# Altium project Grad_Source.PrjPcb
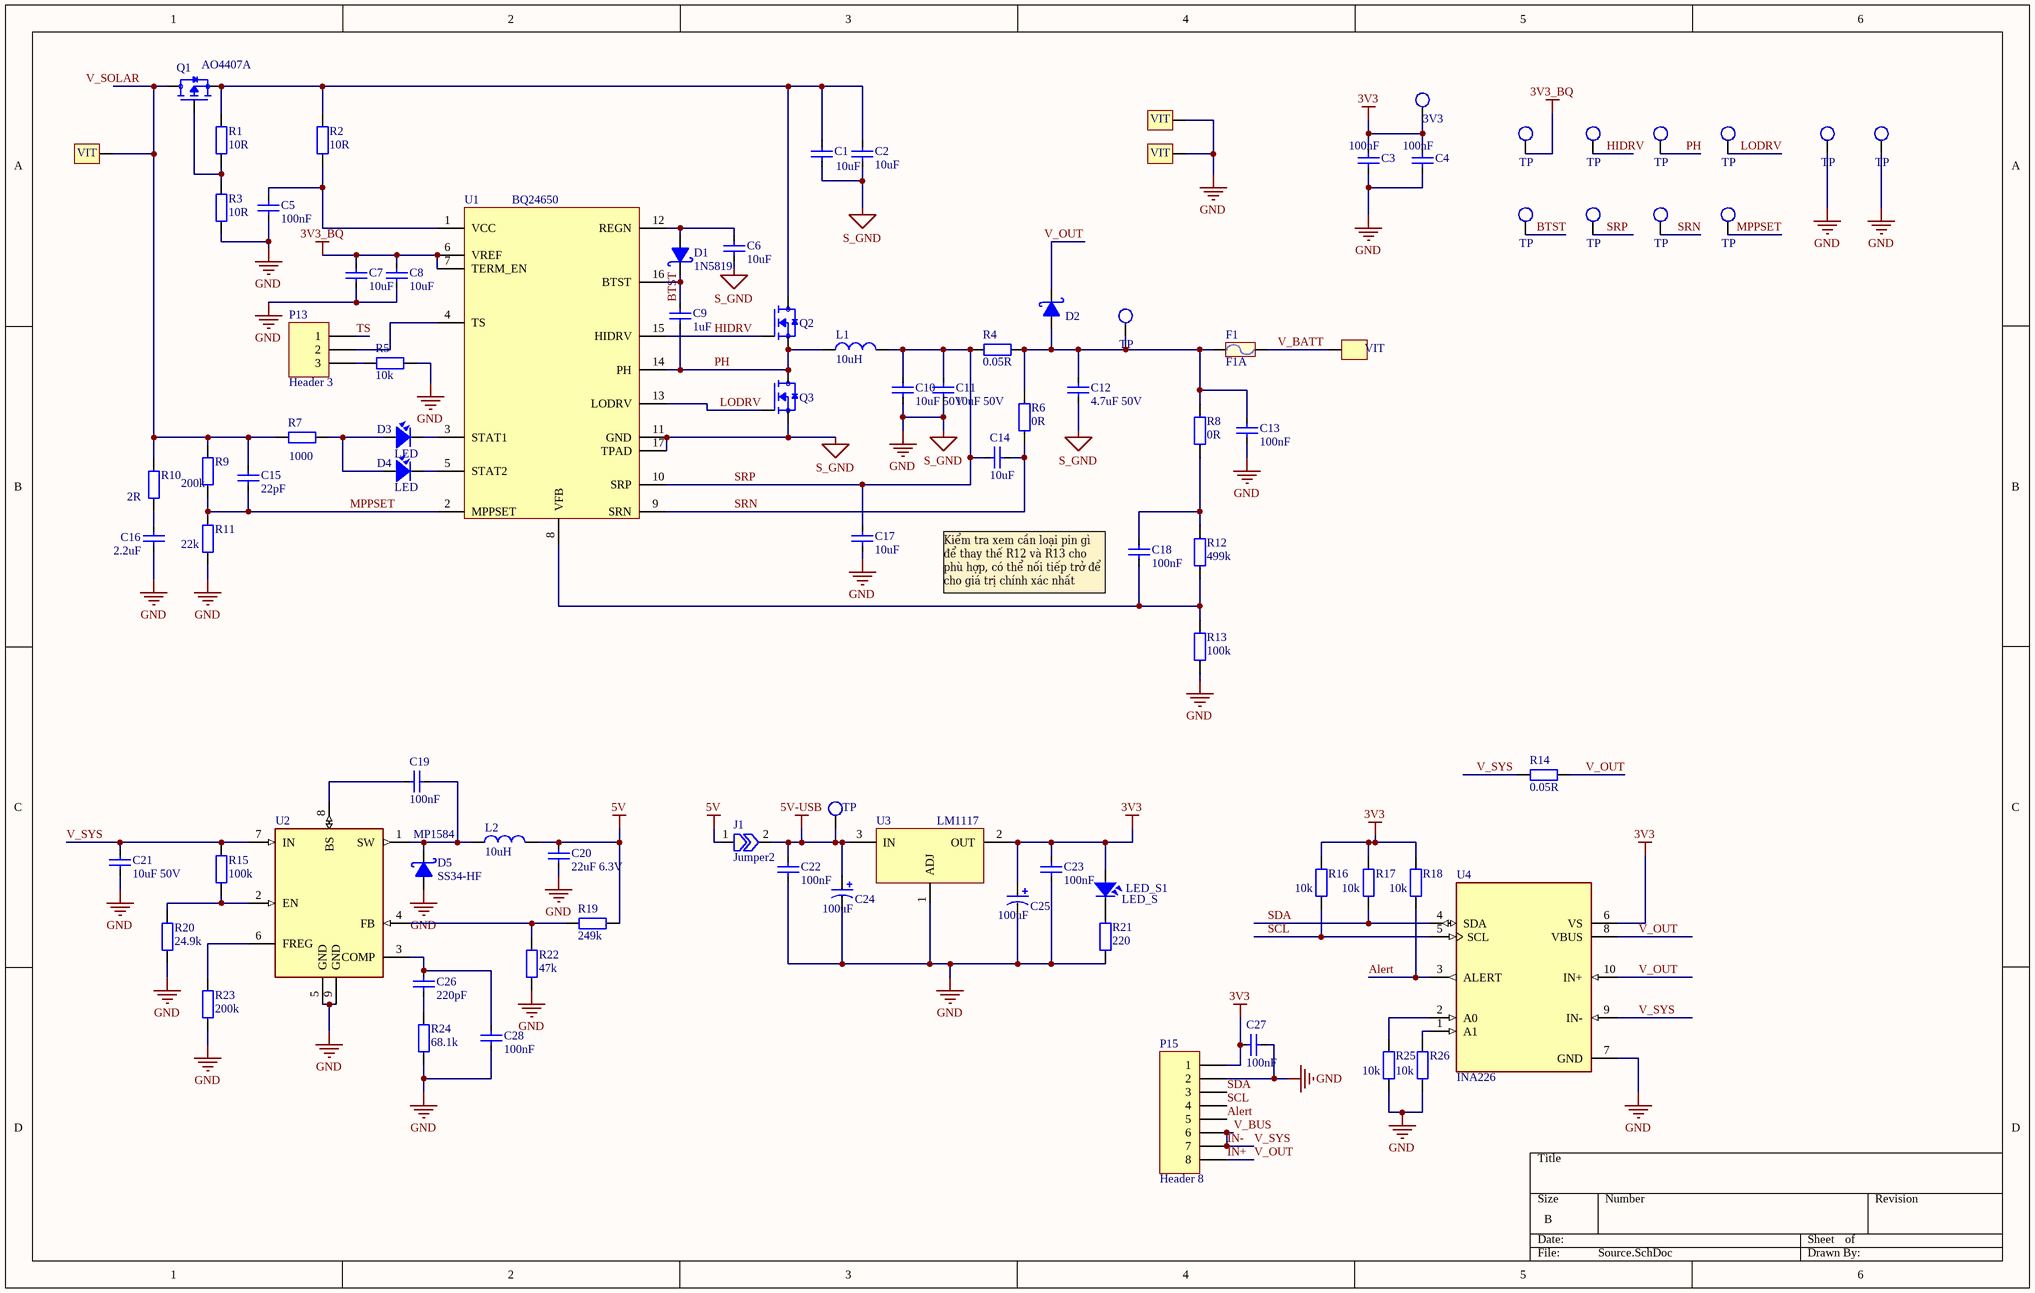
[diagram p0: Source.SchDoc]
2 sheets, 125 parts. Net scope: global (net labels, ports and power ports of the same name join across sheets).
Board file: Source_module.PcbDoc
Sheets:
  Source.SchDoc
  Controller.SchDoc

## Sheet Source.SchDoc
size B; SheetNumber: 1; SheetTotal: 2

### Parts
C1  10uF  [CAP_3216]
C2  10uF  [CAP_3216]
C3  100nF  [CAP_0805]
C4  100nF  [CAP_0805]
C5  100nF  [CAP_0805]
C6  10uF  [CAP_0805]
C7  10uF  [CAP_0805]
C8  10uF  [CAP_0805]
C9  1uF  [CAP_0805]
C10  10uF 50V  [CAP_1206]
C11  10uF 50V  [CAP_1206]
C12  4.7uF 50V  [CAP_1206]
C13  100nF  [CAP_0805]
C14  10uF  [CAP_0805]
C15  22pF  [CAP_0805]
C16  2.2uF  [CAP_0805]
C17  10uF  [CAP_0805]
C18  100nF  [CAP_0805]
C19  100nF  [CAP_0805]
C20  22uF 6.3V  [CAP_0805]
C21  10uF 50V  [CAP_3216]
C22  100nF  [CAP_0805]
C23  100nF  [CAP_0805]
C24  100uF  [CAP_7343]
C25  100uF  [CAP_7343]
C26  220pF  [CAP_0805]
C27  100nF  [CAP_0805]
C28  100nF  [CAP_0805]
D1  1N5819  [DIO-SMD-123]
D2  Diode Schottky  [DIO-214AA(SMB)]  (value not drawn)
D3  LED  [LED-0805-Green]
D4  LED  [LED-0805-Red]
D5  SS34-HF  [SMA]
F1  F1A  [RES-SMD-1812]
J1  Jumper2  [RES-SMD-0402]  (no BOM)
L1  10uH  [L-SMD-M-12x10]
L2  10uH  [L-SMD-M-7.3x4.5]
LED_S1  LED_S  [LED-0805-Blue]
P1  3V3  [Testpoint 50ml]  (no BOM)
P2  TP  [Testpoint 50ml]  (no BOM)
P3  TP  [Testpoint 50ml]  (no BOM)
P4  TP  [Testpoint 50ml]  (no BOM)
P5  TP  [Testpoint 50ml]  (no BOM)
P6  TP  [Testpoint 50ml]  (no BOM)
P7  TP  [Testpoint 50ml]  (no BOM)
P8  TP  [Testpoint 50ml]  (no BOM)
P9  TP  [Testpoint 50ml]  (no BOM)
P10  TP  [Testpoint 50ml]  (no BOM)
P11  TP  [Testpoint 50ml]  (no BOM)
P12  TP  [Testpoint 50ml]  (no BOM)
P13  Header 3  [HDR1X3]  (no BOM)
P14  TP  [Testpoint 50ml]  (no BOM)
P15  Header 8  [HDR1X8]  (no BOM)
Q1  AO4407A  [SOIC-8]
Q2  AON6508  [MOSFET_HP_8Pin]  (value not drawn)
Q3  AON6508  [MOSFET_HP_8Pin]  (value not drawn)
R1  10R  [RES-SMD-0805]
R2  10R  [RES-SMD-0805]
R3  10R  [RES-SMD-0805]
R4  0.05R  [RES-SMD-2512]
R5  10k  [RES-SMD-0805]
R6  0R  [RES-SMD-0805]
R7  1000  [RES-SMD-0805]
R8  0R  [RES-SMD-0805]
R9  200k  [RES-SMD-0805]
R10  2R  [RES-SMD-2512]
R11  22k  [RES-SMD-0805]
R12  499k  [RES-SMD-0805]
R13  100k  [RES-SMD-0805]
R14  0.05R  [RES-SMD-2512]
R15  100k  [RES-SMD-0805]
R16  10k  [RES-SMD-0805]
R17  10k  [RES-SMD-0805]
R18  10k  [RES-SMD-0805]
R19  249k  [RES-SMD-0805]
R20  24.9k  [RES-SMD-0805]
R21  220  [RES-SMD-0805]
R22  47k  [RES-SMD-0805]
R23  200k  [RES-SMD-0805]
R24  68.1k  [RES-SMD-0805]
R25  10k  [RES-SMD-0805]
R26  10k  [RES-SMD-0805]
U1  BQ24650  [VQFN-16]
U2  MP1584  [SOP8-PP]
U3  LM1117  [SOT-223]
U4  INA226  [VSSOP-10]
VIT1  1  [VIT]  (value not drawn)  (no BOM)
VIT2  1  [VIT]  (value not drawn)  (no BOM)
VIT3  1  [VIT]  (value not drawn)  (no BOM)
VIT4  1  [VIT]  (value not drawn)  (no BOM)

### Nets
3V3: C3.2 C4.2 C23.2 C25.1 C27.2 LED_S1.1 P1.1 P15.1 R16.1 R17.1 R18.1 U3.2(OUT) U4.6(VS)
3V3_BQ: C7.2 C8.2 P2.1 U1.6(VREF) U1.7(TERM_EN)
5V: C20.2 J1.1 L2.2 R19.1
5V-USB: C22.2 C24.1 J1.2 P14.1 U3.3(IN)
GND: C1.1 C2.1 C3.1 C4.1 C5.1 C6.1 C7.1 C8.1 C10.1 C11.1 C12.2 C13.1 C16.1 C17.1 C20.1 C21.1 C22.1 C23.1 C24.2 C25.2 C27.1 C28.1 D5.1(A) P6.1 P7.1 P15.2 Q3.1,2,3(S) R3.2 R5.2 R11.2 R13.2 R20.2 R21.2 R22.2 R23.2 R24.2 R25.2 R26.2 U1.11(GND) U1.17(TPAD) U2.5(GND) U2.9(GND) U3.1(ADJ) U4.7(GND) VIT1.VIT1 VIT3.VIT1  [also labelled S_GND]
Alert: P15.5 R18.2 U4.3(ALERT)
BTST: C9.2 D1.2(K) P8.1 U1.16(BTST)
HIDRV: P3.1 Q2.4(G) U1.15(HIDRV)
IN+: D2.2(K) P15.8 R14.1 U4.8(VBUS) U4.10(IN+)  [also labelled V_OUT]
IN-: C21.2 P15.6 P15.7 R14.2 R15.1 U2.7(IN) U4.9(IN-)  [also labelled V_BUS, V_SYS]
LODRV: P5.1 Q3.4(G) U1.13(LODRV)
MPPSET: C15.1 P11.1 R9.2 R11.1 U1.2(MPPSET)
PH: C9.1 L1.1 P4.1 Q2.1,2,3(S) Q3.5,6,7,8,9(D) U1.14(PH)
SCL: P15.4 R16.2 U4.5(SCL)
SDA: P15.3 R17.2 U4.4(SDA)
SRN: C14.1 P10.1 R6.2 U1.9(SRN)
SRP: C10.2 C11.2 C14.2 C17.2 L1.2 P9.1 R4.2 U1.10(SRP)
TS: P13.1
V_BATT: F1.2 VIT4.VIT1
V_SOLAR: C15.2 Q1.5,_6,_7,_8(D) R7.2 R9.1 R10.1 VIT2.VIT1
NetC1_2: C1.2 C2.2 Q1.1,_2,_3(S) Q2.5,6,7,8,9(D) R1.1 R2.1
NetC5_2: C5.2 R2.2 U1.1(VCC)
NetC6_2: C6.2 D1.1(A) U1.12(REGN)
NetC12_1: C12.1 C13.2 D2.1(A) F1.1 P12.1 R4.1 R6.1 R8.1
NetC16_2: C16.2 R10.2
NetC18_1: C18.1 R12.2 R13.1 U1.8(VFB)
NetC18_2: C18.2 R8.2 R12.1
NetC19_1: C19.1 U2.8(BS)
NetC19_2: C19.2 D5.2(K) L2.1 U2.1(SW)
NetC26_1: C26.1 R24.1
NetC26_2: C26.2 C28.2 U2.3(COMP)
NetD3_1: D3.1 D4.1 R7.1
NetD3_2: D3.2 U1.3(STAT1)
NetD4_2: D4.2 U1.5(STAT2)
NetLED_S1_2: LED_S1.2 R21.1
NetP13_2: P13.2 U1.4(TS)
NetP13_3: P13.3 R5.1
NetQ1_4: Q1.4(G) R1.2 R3.1
NetR15_2: R15.2 R20.1 U2.2(EN)
NetR19_2: R19.2 R22.1 U2.4(FB)
NetR23_1: R23.1 U2.6(FREG)
NetR25_1: R25.1 U4.2(A0)
NetR26_1: R26.1 U4.1(A1)

### Notes on the sheet
- (near C18) Kiểm tra xem cần loại pin gì để thay thế R12 và R13 cho phù hợp, có thể nối tiếp trở để cho giá trị chính xác nhất

### Library data of the parts
C1 C2 = CapSMD: C 3216; Value: 33p; Published: 8-Jun-2000; LatestRevisionDate: 17-Jul-2002; LatestRevisionNote: Re-released for DXP Platform.; PackageReference: RAD-0.3; Publisher: Altium Limited
C3-C9 C13-C20 C22 C23 C26-C28 = CapSMD: C 0805; Value: 33p; Published: 8-Jun-2000; LatestRevisionDate: 17-Jul-2002; LatestRevisionNote: Re-released for DXP Platform.; PackageReference: RAD-0.3; Publisher: Altium Limited
C10-C12 C21 = CapSMD: C 1206; Value: 33p; Published: 8-Jun-2000; LatestRevisionDate: 17-Jul-2002; LatestRevisionNote: Re-released for DXP Platform.; PackageReference: RAD-0.3; Publisher: Altium Limited
C24 C25 = CAP_TAN_SMD: C Tan 7343
D1 D5 = 1N5822: Schottky Rectifiers; Value: Diode c?m 1N5408
D2 = Diode Schottky: SS54
D3 D4 LED_S1 = LED: LED Single colour Green and Red; Value: LED 3 ly Single Colour
F1 = Fuse: Fuse 5A; Designed by: VanDungEvn; Value: Fuse
J1 = Jumper2: Jumper, 2-Pin
L1 = Inductor: Value: 150 mH
L2 = Inductor: 6.8-10uH; Value: 150 mH
P1-P12 P14 = TP_1: Test Point; Value: Test Point
P13 = Header 3: Header, 3-Pin; LatestRevisionDate: 17-Jul-2002; LatestRevisionNote: Re-released for DXP Platform.; Publisher: Altium Limited
P15 = Header 8: Header, 8-Pin; LatestRevisionDate: 17-Jul-2002; LatestRevisionNote: Re-released for DXP Platform.; Publisher: Altium Limited
Q1 = MOSFET-P: MFET-ChP; ComponentLink1Description: New link; ComponentLink1URL: https://linhkien.cxtvn.com/3834-ru20p7c-mosfet-p-ch-5a-20v-sot-23.html
Q2 Q3 = MOSFET-N: MFET-CHP
R1-R3 R5-R7 R15-R18 R21 R23-R26 = Resistor - SMD: R 0805; Manufacturer: Generic Components; Class: Passive; Published: 08/06/2000; Publisher: Altium Hobart Technology Centre
R4 R14 = Resistor - SMD: R 2512 1%; Manufacturer: Generic Components; Class: Passive; Published: 08/06/2000; Publisher: Altium Hobart Technology Centre
R8 R9 R11-R13 R19 R20 R22 = Resistor - SMD: R 0805 1%; Manufacturer: Generic Components; Class: Passive; Published: 08/06/2000; Publisher: Altium Hobart Technology Centre
R10 = Resistor - SMD: R 2512; Manufacturer: Generic Components; Class: Passive; Published: 08/06/2000; Publisher: Altium Hobart Technology Centre
U1 = BQ24650: BQ24650 Stand-Alone Synchronous Buck Battery Charge Controller for Solar Power / With Maximum Power Point Tracking
U2 = MP1584: MP1584, The wide 4.5V to 28V input range accommodates a   variety   of   step-down   applications, SOIC8E
U3 = LM1117: 3V3 5V LDO, AMS1117, LDI1117; Creator: Nguyen Ba Bien; Website: http://group3i.net
U4 = INA226: Current Sensing IC
VIT1-VIT4 = VIT: Oc Vit

## Sheet Controller.SchDoc
size A4; SheetNumber: 2; SheetTotal: 2
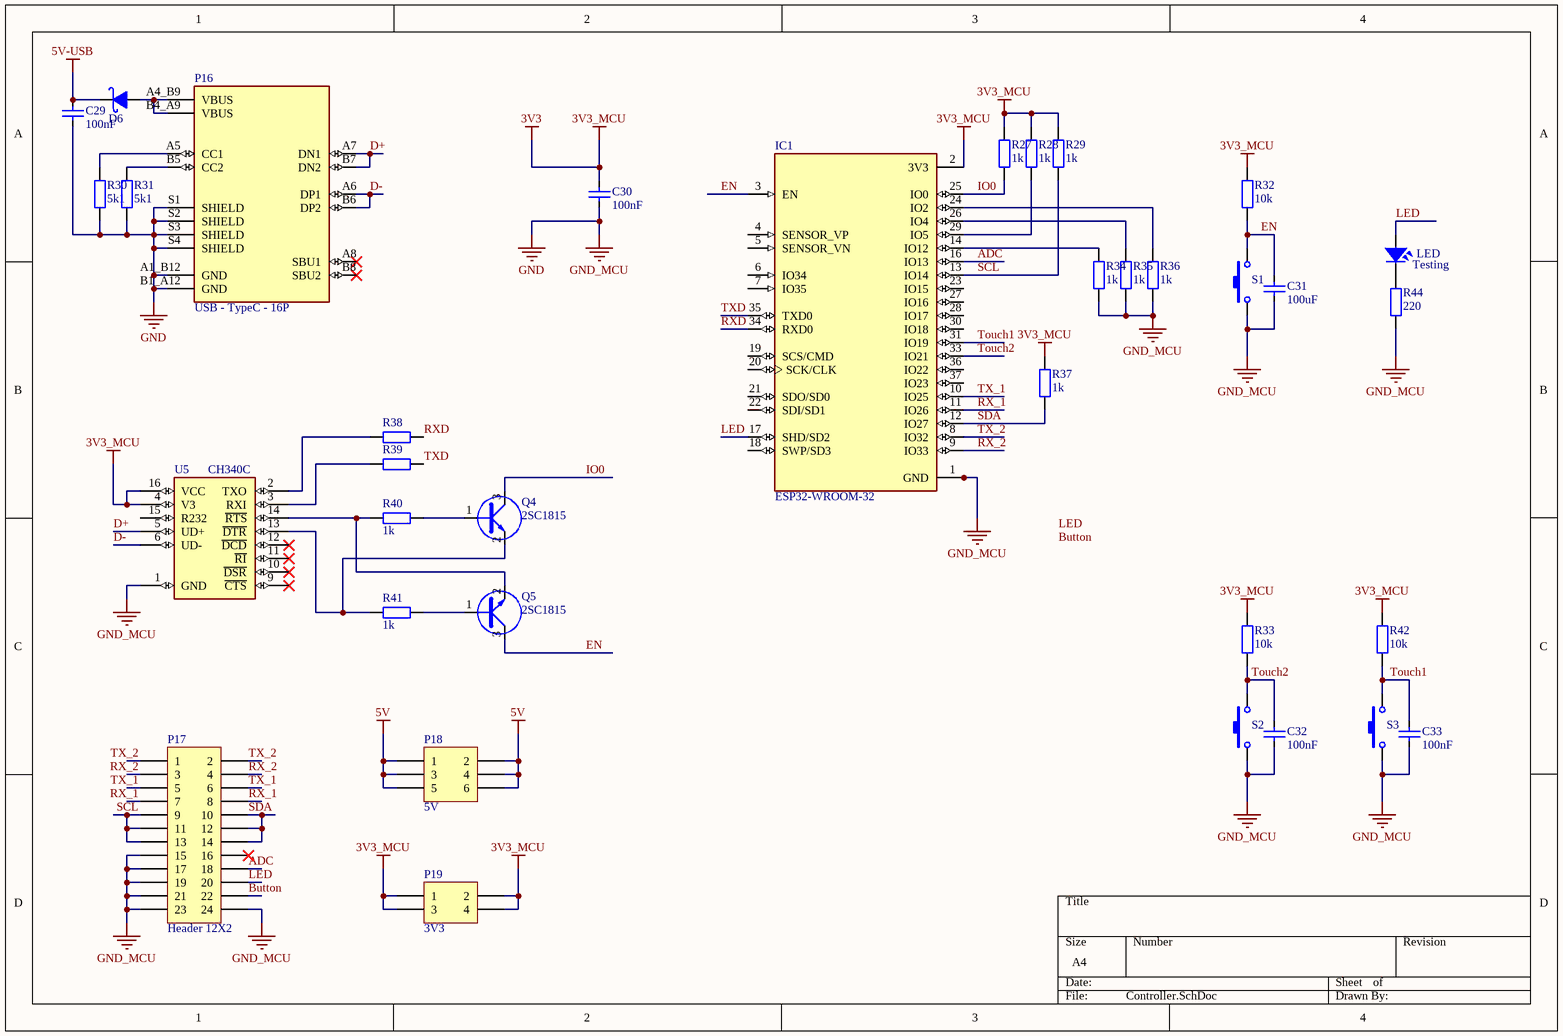
[diagram p1: Controller.SchDoc]

### Parts
C29  100nF  [CAP_0805]
C30  100nF  [CAP_0805]
C31  100uF  [CAP_0805]
C32  100nF  [CAP_0805]
C33  100nF  [CAP_0805]
D6  Diode Schottky  [DIO-214AA(SMB)]  (value not drawn)
IC1  ESP32-WROOM-32  [MODULE_ESP32-WROOM-32]
LED  Testing  [LED-0805-Blue]
P16  USB - TypeC - 16P  [USB C 16P]
P17  Header 12X2  [HDR2X12]  (no BOM)
P18  5V  [HDR2X3]  (no BOM)
P19  3V3  [HDR2X2]  (no BOM)
Q4  2SC1815  [SOT23D]
Q5  2SC1815  [SOT23D]
R27  1k  [RES-SMD-0805]
R28  1k  [RES-SMD-0805]
R29  1k  [RES-SMD-0805]
R30  5k1  [RES-SMD-0805]
R31  5k1  [RES-SMD-0805]
R32  10k  [RES-SMD-0805]
R33  10k  [RES-SMD-0805]
R34  1k  [RES-SMD-0805]
R35  1k  [RES-SMD-0805]
R36  1k  [RES-SMD-0805]
R37  1k  [RES-SMD-0805]
R38  0R  [RES-SMD-0805]  (value not drawn)
R39  0R  [RES-SMD-0805]  (value not drawn)
R40  1k  [RES-SMD-0805]
R41  1k  [RES-SMD-0805]
R42  10k  [RES-SMD-0805]
R44  220  [RES-SMD-0805]
S1  SW-SMD  [SW 3x2x4]  (value not drawn)
S2  SW-SMD  [SW 3x2x4]  (value not drawn)
S3  SW-SMD  [SW 3x2x4]  (value not drawn)
U5  CH340C  [SOP-16]

### Nets
3V3: C30.2 IC1.2(3V3) P19.1 P19.2 P19.3 P19.4 R27.1 R28.1 R29.1 R32.1 R33.1 R37.1 R42.1 U5.4(V3) U5.16(VCC)  [also labelled 3V3_MCU]
5V: P18.1 P18.2 P18.3 P18.4 P18.5 P18.6
5V-USB: C29.2 D6.2(K)
GND: C29.1 C30.1 C31.1 C32.1 C33.1 IC1.1(GND) IC1.15(GND) IC1.38(GND) IC1.39_1(GND) IC1.39_2(GND) IC1.39_3(GND) IC1.39_4(GND) IC1.39_5(GND) IC1.39_6(GND) IC1.39_7(GND) IC1.39_8(GND) IC1.39_9(GND) IC1.39_10(GND) IC1.39_11(GND) IC1.39_12(GND) IC1.39_13(GND) IC1.39_14(GND) IC1.39_15(GND) IC1.39_16(GND) IC1.39_17(GND) IC1.39_18(GND) IC1.39_19(GND) IC1.39_20(GND) IC1.39_21(GND) P16.A1_B12(GND) P16.B1_A12(GND) P16.S1(SHIELD) P16.S2(SHIELD) P16.S3(SHIELD) P16.S4(SHIELD) P17.15 P17.17 P17.19 P17.21 P17.23 P17.24 R30.2 R31.2 R34.2 R35.2 R36.1 R44.2 S1.1 S2.1 S3.1 U5.1(GND)  [also labelled GND_MCU]
ADC: IC1.16(IO13) P17.18
Button: P17.22
D+: P16.A7(DN1) P16.B7(DN2) U5.5(UD+)
D-: P16.A6(DP1) P16.B6(DP2) U5.6(UD-)
EN: C31.2 IC1.3(EN) Q5.3(C) R32.2 S1.2
IO0: IC1.25(IO0) Q4.3(C) R27.2
LED: IC1.17(SHD/SD2) LED.1 P17.20
RX_1: IC1.11(IO26) P17.7 P17.8
RX_2: IC1.9(IO33) P17.3 P17.4
RXD: IC1.34(RXD0) R38.1
SCL: IC1.13(IO14) P17.9 P17.11 P17.13 R29.2
SDA: IC1.12(IO27) P17.10 P17.12 P17.14 R37.2
Touch1: C33.2 IC1.31(IO19) R42.2 S3.2
Touch2: C32.2 IC1.33(IO21) R33.2 S2.2
TX_1: IC1.10(IO25) P17.5 P17.6
TX_2: IC1.8(IO32) P17.1 P17.2
TXD: IC1.35(TXD0) R39.1
NetD6_1: D6.1(A) P16.A4_B9(VBUS) P16.B4_A9(VBUS)
NetIC1_14: IC1.14(IO12) R34.1
NetIC1_24: IC1.24(IO2) R36.2
NetIC1_26: IC1.26(IO4) R35.1
NetIC1_29: IC1.29(IO5) R28.2
NetLED_2: LED.2 R44.1
NetP16_A5: P16.A5(CC1) R30.1
NetP16_B5: P16.B5(CC2) R31.1
NetQ4_1: Q4.1(B) R40.1
NetQ4_2: Q4.2(E) R41.2 U5.13(~{DTR})
NetQ5_1: Q5.1(B) R41.1
NetQ5_2: Q5.2(E) R40.2 U5.14(~{RTS})
NetR38_2: R38.2 U5.2(TXO)
NetR39_2: R39.2 U5.3(RXI)

Not connected (* = marked no-connect by the designer): IC1 4(SENSOR_VP) 5(SENSOR_VN) 6(IO34) 7(IO35) 18(SWP/SD3) 19(SCS/CMD) 20(SCK/CLK) 21(SDO/SD0) 22(SDI/SD1) 23(IO15) 27(IO16) 28(IO17) 30(IO18) 36(IO22) 37(IO23); P16 A8(SBU1)* B8(SBU2)*; P17 16*; U5 9(~{CTS})* 10(~{DSR})* 11(~{RI})* 12(~{DCD})* 15(R232)

### Notes on the sheet
- Labels drawn without touching a wire or pin: Button, LED

### Library data of the parts
C29-C33 = CapSMD: C 0805; Value: 33p; Published: 8-Jun-2000; LatestRevisionDate: 17-Jul-2002; LatestRevisionNote: Re-released for DXP Platform.; PackageReference: RAD-0.3; Publisher: Altium Limited
D6 = Diode Schottky: SS54
IC1 = ESP32-WROOM-32: Bluetooth, WiFi Transceiver Module 2.4GHz ~ 2.5GHz Surface Mount; MF: Espressif Systems; Package: Module Espressif Systems; Digi-Key_Part_Number: 1904-1010-1-ND; Digi-Key_Purchase_URL: https://www.digikey.com/product-detail/en/espressif-systems/ESP32-WROOM-32/1904-1010-1-ND/8544305?utm_source=snapeda&utm_medium=aggregator&utm_campaign=symbol; Value: *; MP: ESP32-WROOM-32; SnapEDA_Link: https://www.snapeda.com/parts/ESP32-WROOM-32/Espressif%20Systems/view-part/2753322/?ref=snap
LED = LED: as D3 on sheet Source
P17 = Header 12X2: Header, 12-Pin, Dual row; LatestRevisionDate: 17-Jul-2002; LatestRevisionNote: Re-released for DXP Platform.; Publisher: Altium Limited
P18 = Header 3X2: Header, 3-Pin, Dual row; LatestRevisionDate: 17-Jul-2002; LatestRevisionNote: Re-released for DXP Platform.; Publisher: Altium Limited
P19 = Header 2X2: Header, 2-Pin, Dual row; LatestRevisionDate: 17-Jul-2002; LatestRevisionNote: Re-released for DXP Platform.; Publisher: Altium Limited
Q4 Q5 = C1815: NPN 600mW, ECB; Value: C1815
R27-R42 R44 = Resistor - SMD: as R1 on sheet Source; Published: 08/06/2000; Publisher: Altium Hobart Technology Centre
S1-S3 = SW-SMD: Switch; Published: 24-Mar-1999; LatestRevisionDate: 17-Jul-2002; LatestRevisionNote: Re-released for DXP Platform.; PackageReference: SPST-2; Publisher: Altium Limited
U5 = CH340C: USB to serial chip CH340; MF: WCH; Package: Package; Check_prices: https://www.snapeda.com/parts/CH340C/WCH/view-part/5428851/?ref=eda; Value: *; Price: None; MP: CH340C; Availability: Unavailable; SnapEDA_Link: https://www.snapeda.com/parts/CH340C/WCH/view-part/5428851/?ref=snap
P16 = USB - TypeC - 16P: ComponentLink1Description: New link; ComponentLink1URL: https://linhkien.cxtvn.com/6914-cong-type-c-cai-16p-usb-31-v2.html

## Nets that join several sheets
3V3: Source (13 pins), Controller (15 pins)
5V: Source (C20.2 J1.1 L2.2 R19.1), Controller (6 pins)
5V-USB: Source (5 pins), Controller (C29.2 D6.2)
GND: Source (46 pins), Controller (51 pins)
SCL: Source (P15.4 R16.2 U4.5), Controller (5 pins)
SDA: Source (P15.3 R17.2 U4.4), Controller (5 pins)